# Altium schematic sheet Sampling.SchDoc
size A4; SheetNumber: 2; SheetTotal: 3
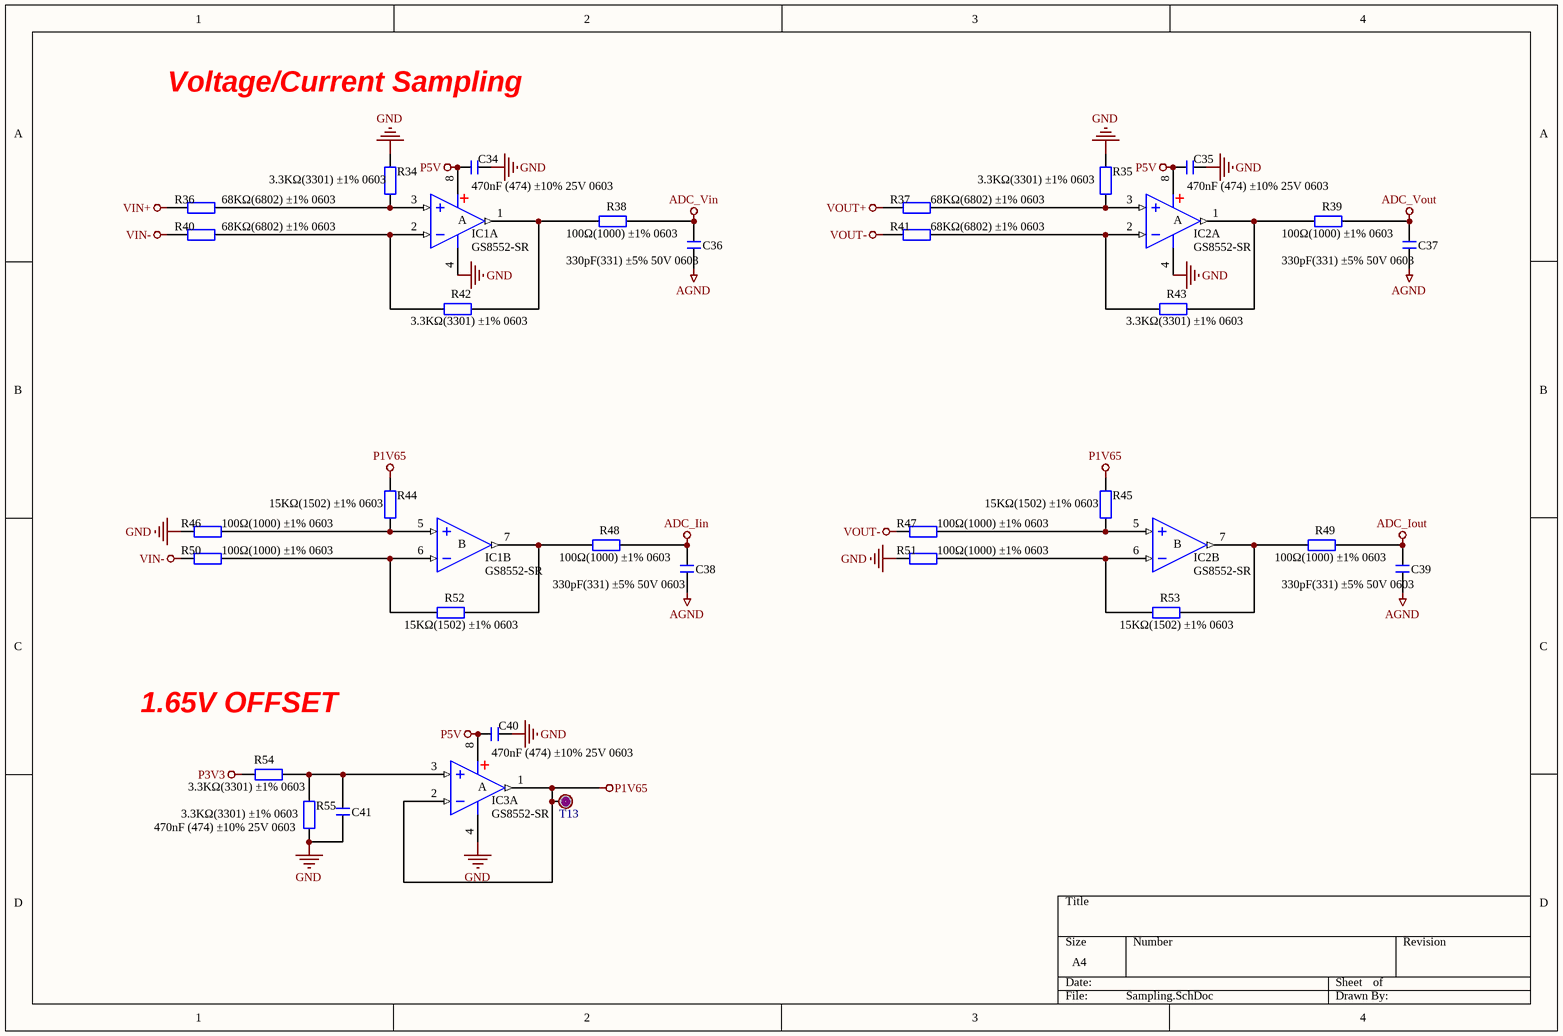
[diagram p0: Sampling.SchDoc]

## Parts
C34  470nF (474) ±10% 25V 0603  [C 0603_L]
C35  470nF (474) ±10% 25V 0603  [C 0603_L]
C36  330pF(331) ±5% 50V 0603  [C 0603_L]
C37  330pF(331) ±5% 50V 0603  [C 0603_L]
C38  330pF(331) ±5% 50V 0603  [C 0603_L]
C39  330pF(331) ±5% 50V 0603  [C 0603_L]
C40  470nF (474) ±10% 25V 0603  [C 0603_L]
C41  470nF (474) ±10% 25V 0603  [C 0603_L]
IC1  GS8552-SR  [SOP8_N]  (parts A,B of 2)
IC2  GS8552-SR  [SOP8_N]  (parts A,B of 2)
IC3  GS8552-SR  [SOP8_N]  (part A of 2)
R34  3.3KΩ(3301) ±1% 0603  [R 0603_L]
R35  3.3KΩ(3301) ±1% 0603  [R 0603_L]
R36  68KΩ(6802) ±1% 0603  [R 0603_L]
R37  68KΩ(6802) ±1% 0603  [R 0603_L]
R38  100Ω(1000) ±1% 0603  [R 0603_L]
R39  100Ω(1000) ±1% 0603  [R 0603_L]
R40  68KΩ(6802) ±1% 0603  [R 0603_L]
R41  68KΩ(6802) ±1% 0603  [R 0603_L]
R42  3.3KΩ(3301) ±1% 0603  [R 0603_L]
R43  3.3KΩ(3301) ±1% 0603  [R 0603_L]
R44  15KΩ(1502) ±1% 0603  [R 0603_L]
R45  15KΩ(1502) ±1% 0603  [R 0603_L]
R46  100Ω(1000) ±1% 0603  [R 0603_L]
R47  100Ω(1000) ±1% 0603  [R 0603_L]
R48  100Ω(1000) ±1% 0603  [R 0603_L]
R49  100Ω(1000) ±1% 0603  [R 0603_L]
R50  100Ω(1000) ±1% 0603  [R 0603_L]
R51  100Ω(1000) ±1% 0603  [R 0603_L]
R52  15KΩ(1502) ±1% 0603  [R 0603_L]
R53  15KΩ(1502) ±1% 0603  [R 0603_L]
R54  3.3KΩ(3301) ±1% 0603  [R 0603_L]
R55  3.3KΩ(3301) ±1% 0603  [R 0603_L]
T13  TestP  [TestP]  (value not drawn)

## Nets
ADC_Iin: C38.2 R48.2
ADC_Iout: C39.2 R49.2
ADC_Vin: C36.2 R38.2
ADC_Vout: C37.2 R39.2
AGND: C36.1 C37.1 C38.1 C39.1
GND: C34.1 C35.1 C40.1 C41.2 IC1.4(V-) IC2.4(V-) IC3.4(V-) R34.2 R35.2 R46.1 R51.1 R55.2
P1V65: IC3.1(OUT) IC3.2(IN-) R44.2 R45.2 T13.0
P3V3: R54.2
P5V: C34.2 C35.2 C40.2 IC1.8(V+) IC2.8(V+) IC3.8(V+)
VIN+: R36.1
VIN-: R40.1 R50.1
VOUT+: R37.1
VOUT-: R41.1 R47.1
NetC41_1: C41.1 IC3.3(IN+) R54.1 R55.1
NetIC1_1: IC1.1(OUT) R38.1 R42.2
NetIC1_2: IC1.2(IN-) R40.2 R42.1
NetIC1_3: IC1.3(IN+) R34.1 R36.2
NetIC1_5: IC1.5(IN+) R44.1 R46.2
NetIC1_6: IC1.6(IN-) R50.2 R52.1
NetIC1_7: IC1.7(OUT) R48.1 R52.2
NetIC2_1: IC2.1(OUT) R39.1 R43.2
NetIC2_2: IC2.2(IN-) R41.2 R43.1
NetIC2_3: IC2.3(IN+) R35.1 R37.2
NetIC2_5: IC2.5(IN+) R45.1 R47.2
NetIC2_6: IC2.6(IN-) R51.2 R53.1
NetIC2_7: IC2.7(OUT) R49.1 R53.2

## Notes on the sheet
- Voltage/Current Sampling
- 1.65V OFFSET
- (in symbol LM358, part A) A
- (in symbol LM358, part B) B

## Library data of the parts
C34-C41 = C: 贴片电容; BOM名称: 无极性贴片电容; 淘宝ID: 封装库来自淘宝 ID：黄晶宝石; 联系售后，技术支持: https://shop463601444.taobao.com; 唯一出售店铺网址: https://shop463601444.taobao.com
IC1-IC3 = LM358: 双路运放; 版权归属: 源创客; BOM名称: 双路运放; 封装库来自淘宝 ID：黄晶宝石: https://shop463601444.taobao.com
R34-R55 = R: 贴片电阻; 版权归属: 来自淘宝 ID：黄晶宝石; 封装库来自淘宝卖家 ID：黄晶宝石: 其他店铺购入均为盗版，不享受售后技术支持服务，请立即申请退款; BOM名称: 贴片电阻; 联系售后: https://shop463601444.taobao.com